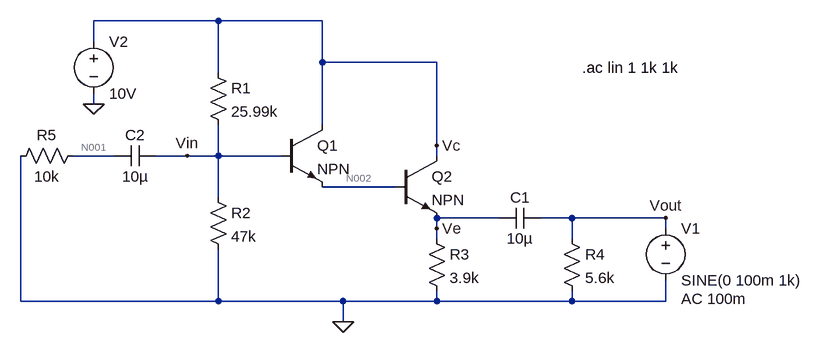
[diagram p0: schematic Darlington - Rout.asc]
Darlington - Rout.asc, the LTspice schematic file:
Version 4
SHEET 1 1452 680
WIRE 368 -64 176 -64
WIRE 528 -64 368 -64
WIRE 176 -32 176 -64
WIRE 528 0 528 -64
WIRE 704 0 528 0
WIRE 368 16 368 -64
WIRE 176 64 176 48
WIRE 528 96 528 0
WIRE 704 128 704 0
WIRE 208 144 144 144
WIRE 320 144 272 144
WIRE 368 144 368 96
WIRE 368 144 320 144
WIRE 464 144 368 144
WIRE 704 144 704 128
WIRE 640 192 528 192
WIRE 368 208 368 144
WIRE 800 240 704 240
WIRE 912 240 864 240
WIRE 1056 240 912 240
WIRE 704 256 704 240
WIRE 1056 256 1056 240
WIRE 704 272 704 256
WIRE 912 272 912 240
WIRE 64 368 64 144
WIRE 368 368 368 288
WIRE 368 368 64 368
WIRE 560 368 368 368
WIRE 704 368 704 352
WIRE 704 368 560 368
WIRE 912 368 912 352
WIRE 912 368 704 368
WIRE 1056 368 1056 336
WIRE 1056 368 912 368
WIRE 560 400 560 368
FLAG 176 64 0
FLAG 560 400 0
FLAG 704 128 Vc
FLAG 704 256 Ve
FLAG 320 144 Vin
FLAG 1056 240 Vout
SYMBOL voltage 1056 240 R0
WINDOW 123 24 124 Left 2
WINDOW 39 0 0 Left 0
SYMATTR Value2 AC 100m
SYMATTR InstName V1
SYMATTR Value SINE(0 100m 1k)
SYMBOL voltage 176 -48 R0
SYMATTR InstName V2
SYMATTR Value 10V
SYMBOL res 352 0 R0
SYMATTR InstName R1
SYMATTR Value 25.99k
SYMBOL res 352 192 R0
SYMATTR InstName R2
SYMATTR Value 47k
SYMBOL res 688 256 R0
SYMATTR InstName R3
SYMATTR Value 3.9k
SYMBOL res 896 256 R0
SYMATTR InstName R4
SYMATTR Value 5.6k
SYMBOL res 160 128 R90
WINDOW 0 0 56 VBottom 2
WINDOW 3 32 56 VTop 2
SYMATTR InstName R5
SYMATTR Value 10k
SYMBOL npn 464 96 R0
SYMATTR InstName Q1
SYMBOL npn 640 144 R0
SYMATTR InstName Q2
SYMBOL cap 864 224 R90
WINDOW 0 0 32 VBottom 2
WINDOW 3 32 32 VTop 2
SYMATTR InstName C1
SYMATTR Value 10µ
SYMBOL cap 272 128 R90
WINDOW 0 0 32 VBottom 2
WINDOW 3 32 32 VTop 2
SYMATTR InstName C2
SYMATTR Value 10µ
TEXT 928 8 Left 2 !.ac lin 1 1k 1k

The netlist it stands for:
* Darlington - Rout.asc
V1 Vout 0 SINE(0 100m 1k) AC 100m
V2 Vc 0 10V
R1 Vc Vin 25.99k
R2 Vin 0 47k
R3 Ve 0 3.9k
R4 Vout 0 5.6k
R5 N001 0 10k
Q1 Vc Vin N002 0 NPN
Q2 Vc N002 Ve 0 NPN
C1 Vout Ve 10µ
C2 Vin N001 10µ
.model NPN NPN
.model PNP PNP
.lib standard.bjt
.ac lin 1 1k 1k
.backanno
.end

* Results of the author's LTspice run, read from the files saved beside the schematic
* Operating Point, zero values left out:
*   V(vc) = 10 V
*   V(vin) = 6.437 V
*   V(ve) = 4.996 V
*   V(n002) = 5.776 V
*   Ic(Q2) = 1.268 mA
*   Ib(Q2) = 12.68 µA
*   Ie(Q2) = -1.281 mA
*   Ic(Q1) = 12.56 µA
*   Ib(Q1) = 125.6 nA
*   Ie(Q1) = -12.68 µA
*   I(R3) = 1.281 mA
*   I(R2) = 137 µA
*   I(R1) = 137.1 µA
*   I(V2) = -1.418 mA
* AC Analysis:
*   frequency = 1 k
*   V(vout) = 100 mV
*   V(vc) = 0 V
*   V(vin) = 1.298 mV
*   V(ve) = 86.66 mV
*   V(n001) = 1.297 mV
*   V(n002) = 43.98 mV
*   Ic(Q2) = -2.093 mA
*   Ib(Q2) = -20.93 µA
*   Ie(Q2) = 2.114 mA
*   Ic(Q1) = -20.72 µA
*   Ib(Q1) = -207.2 nA
*   Ie(Q1) = 20.93 µA
*   I(C2) = 129.7 nA
*   I(C1) = 2.136 mA
*   I(R5) = 129.7 nA
*   I(R4) = 17.86 µA
*   I(R3) = 22.22 µA
*   I(R2) = 27.61 nA
*   I(R1) = -49.93 nA
*   I(V2) = 2.114 mA
*   I(V1) = -2.154 mA